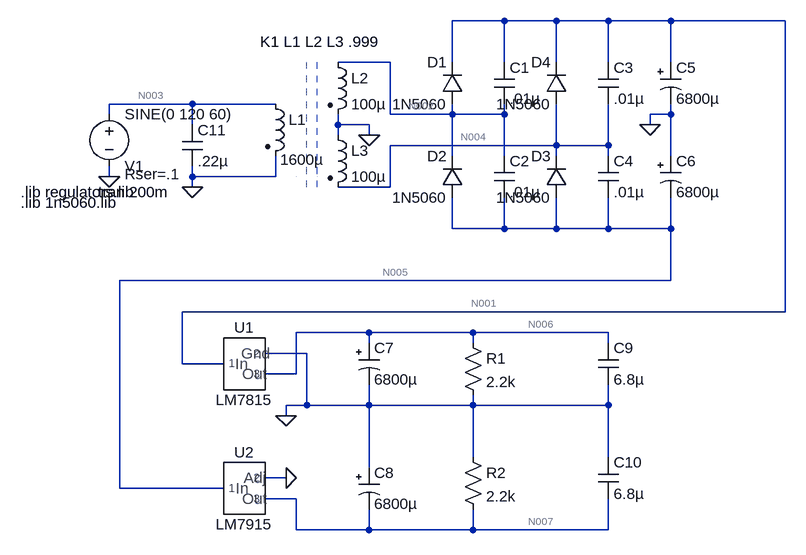
[diagram p0: schematic 15v-supply.asc]
15v-supply.asc, the LTspice schematic file:
Version 4
SHEET 1 964 680
WIRE 528 -192 448 -192
WIRE 608 -192 528 -192
WIRE 688 -192 608 -192
WIRE 784 -192 688 -192
WIRE 960 -192 784 -192
WIRE 352 -128 272 -128
WIRE 448 -128 448 -192
WIRE 528 -128 528 -192
WIRE 608 -128 608 -192
WIRE 688 -128 688 -192
WIRE 784 -128 784 -192
WIRE 48 -64 -80 -64
WIRE 176 -64 48 -64
WIRE -80 -48 -80 -64
WIRE 352 -48 352 -128
WIRE 448 -48 448 -64
WIRE 448 -48 352 -48
WIRE 528 -48 528 -64
WIRE 528 -48 448 -48
WIRE 784 -48 784 -64
WIRE 784 -48 752 -48
WIRE 48 -32 48 -64
WIRE 272 -32 272 -48
WIRE 320 -32 272 -32
WIRE 752 -32 752 -48
WIRE 272 -16 272 -32
WIRE 320 -16 320 -32
WIRE 608 0 608 -64
WIRE 608 0 352 0
WIRE 688 0 688 -64
WIRE 688 0 608 0
WIRE 448 16 448 -48
WIRE 528 16 528 -48
WIRE 608 16 608 0
WIRE 688 16 688 0
WIRE 784 16 784 -48
WIRE -80 48 -80 32
WIRE 48 48 48 32
WIRE 176 48 176 16
WIRE 176 48 48 48
WIRE 48 64 48 48
WIRE 352 64 352 0
WIRE 352 64 272 64
WIRE 448 128 448 80
WIRE 528 128 528 80
WIRE 528 128 448 128
WIRE 608 128 608 80
WIRE 608 128 528 128
WIRE 688 128 688 80
WIRE 688 128 608 128
WIRE 784 128 784 80
WIRE 784 128 688 128
WIRE 784 208 784 128
WIRE 784 208 -64 208
WIRE 960 256 960 -192
WIRE 960 256 32 256
WIRE 320 288 208 288
WIRE 480 288 320 288
WIRE 688 288 480 288
WIRE 320 304 320 288
WIRE 480 304 480 288
WIRE 688 304 688 288
WIRE 224 320 160 320
WIRE 32 336 32 256
WIRE 96 336 32 336
WIRE 208 352 208 288
WIRE 208 352 160 352
WIRE 224 400 224 320
WIRE 224 400 192 400
WIRE 320 400 320 368
WIRE 320 400 224 400
WIRE 480 400 480 384
WIRE 480 400 320 400
WIRE 688 400 688 368
WIRE 688 400 480 400
WIRE 192 416 192 400
WIRE 480 480 480 400
WIRE 688 480 688 400
WIRE 320 496 320 400
WIRE 192 512 160 512
WIRE -64 528 -64 208
WIRE 96 528 -64 528
WIRE 208 544 160 544
WIRE 208 592 208 544
WIRE 320 592 320 560
WIRE 320 592 208 592
WIRE 480 592 480 560
WIRE 480 592 320 592
WIRE 688 592 688 544
WIRE 688 592 480 592
FLAG -80 48 0
FLAG 192 416 0
FLAG 192 512 0
FLAG 320 -16 0
FLAG 752 -32 0
FLAG 48 64 0
SYMBOL voltage -80 -64 R0
WINDOW 0 24 96 Left 2
WINDOW 3 24 16 Left 2
WINDOW 123 0 0 Left 0
WINDOW 39 24 108 Left 2
SYMATTR InstName V1
SYMATTR Value SINE(0 120 60)
SYMATTR SpiceLine Rser=.1
SYMBOL diode 464 -64 R180
WINDOW 0 24 64 Left 2
WINDOW 3 24 0 Left 2
SYMATTR InstName D1
SYMATTR Value 1N5060
SYMBOL diode 464 80 R180
WINDOW 0 24 64 Left 2
WINDOW 3 24 0 Left 2
SYMATTR InstName D2
SYMATTR Value 1N5060
SYMBOL diode 624 80 R180
WINDOW 0 24 64 Left 2
WINDOW 3 24 0 Left 2
SYMATTR InstName D3
SYMATTR Value 1N5060
SYMBOL diode 624 -64 R180
WINDOW 0 24 64 Left 2
WINDOW 3 24 0 Left 2
SYMATTR InstName D4
SYMATTR Value 1N5060
SYMBOL cap 512 -128 R0
SYMATTR InstName C1
SYMATTR Value .01µ
SYMBOL cap 512 16 R0
SYMATTR InstName C2
SYMATTR Value .01µ
SYMBOL cap 672 -128 R0
SYMATTR InstName C3
SYMATTR Value .01µ
SYMBOL cap 672 16 R0
SYMATTR InstName C4
SYMATTR Value .01µ
SYMBOL polcap 768 -128 R0
SYMATTR InstName C5
SYMATTR Value 6800µ
SYMBOL polcap 768 16 R0
SYMATTR InstName C6
SYMATTR Value 6800µ
SYMBOL polcap 304 304 R0
SYMATTR InstName C7
SYMATTR Value 6800µ
SYMBOL polcap 304 496 R0
SYMATTR InstName C8
SYMATTR Value 6800µ
SYMBOL res 464 288 R0
SYMATTR InstName R1
SYMATTR Value 2.2k
SYMBOL res 464 464 R0
SYMATTR InstName R2
SYMATTR Value 2.2k
SYMBOL cap 672 304 R0
SYMATTR InstName C9
SYMATTR Value 6.8µ
SYMBOL cap 672 480 R0
SYMATTR InstName C10
SYMATTR Value 6.8µ
SYMBOL cap 32 -32 R0
SYMATTR InstName C11
SYMATTR Value .22µ
SYMBOL ind2 160 -80 R0
WINDOW 3 23 102 Left 2
SYMATTR Value 1600µ
SYMATTR InstName L1
SYMATTR Type ind
SYMBOL LM7815 128 336 R0
SYMATTR InstName U1
SYMBOL LM7915 128 528 R0
SYMATTR InstName U2
SYMBOL ind2 256 -144 R0
SYMATTR InstName L2
SYMATTR Value 100µ
SYMATTR Type ind
SYMBOL ind2 256 -32 R0
SYMATTR InstName L3
SYMATTR Value 100µ
SYMATTR Type ind
TEXT -216 88 Left 2 !.lib 1n5060.lib
TEXT -104 72 Left 2 !.tran 200m
TEXT -216 72 Left 2 !.lib regulators.lib
TEXT 152 -160 Left 2 !K1 L1 L2 L3 .999
LINE Normal 240 48 240 48 2
LINE Normal 208 48 208 48 2
LINE Normal 224 64 224 -128 2
LINE Normal 240 64 240 -128 2

The netlist it stands for:
* 15v-supply.asc
V1 N003 0 SINE(0 120 60) Rser=.1
D1 N002 N001 1N5060
D2 N005 N002 1N5060
D3 N005 N004 1N5060
D4 N004 N001 1N5060
C1 N001 N002 .01µ
C2 N002 N005 .01µ
C3 N001 N004 .01µ
C4 N004 N005 .01µ
C5 N001 0 6800µ
C6 0 N005 6800µ
C7 N006 0 6800µ
C8 0 N007 6800µ
R1 N006 0 2.2k
R2 0 N007 2.2k
C9 N006 0 6.8µ
C10 0 N007 6.8µ
C11 N003 0 .22µ
L1 N003 0 1600µ
XU1 N001 0 N006 LM7815  ; pins 1 2 3
XU2 N005 0 N007 LM7915  ; pins 1 2 3
L2 N002 0 100µ
L3 0 N004 100µ
.model D D
.lib standard.dio
.lib 1n5060.lib
.tran 200m
.lib regulators.lib
K1 L1 L2 L3 .999
.backanno
.end

* Results of the author's LTspice run, read from the files saved beside the schematic
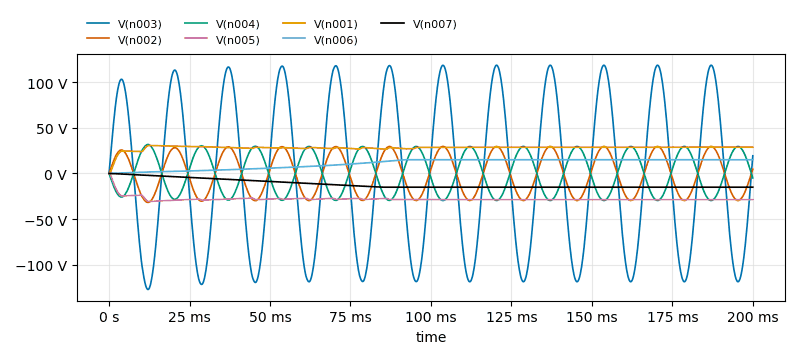
[diagram p1: Transient Analysis of 15v-supply.asc, plotted from the saved traces]
* Transient Analysis, 1 run:
*   V(n003): min -126.9 V, max 118.4 V, average -1.55 V, rms 83.38 V, last 19.35 V
*   V(n002): min -31.65 V, max 29.56 V, average -387.1 mV, rms 20.8 V, last 4.834 V
*   V(n004): min -29.56 V, max 31.65 V, average 387.1 mV, rms 20.8 V, last -4.834 V
*   V(n005): min -30.57 V, max 0 V, average -28.02 V, rms 28.13 V, last -28.69 V
*   V(n001): min 0 V, max 30.6 V, average 28.06 V, rms 28.18 V, last 28.71 V
*   V(n006): min 0 V, max 15.01 V, average 10.86 V, rms 12.07 V, last 15 V
*   V(n007): min -15.01 V, max 0 V, average -11.78 V, rms 12.69 V, last -15 V